# EAGLE schematic controller (EAGLE 6.1)
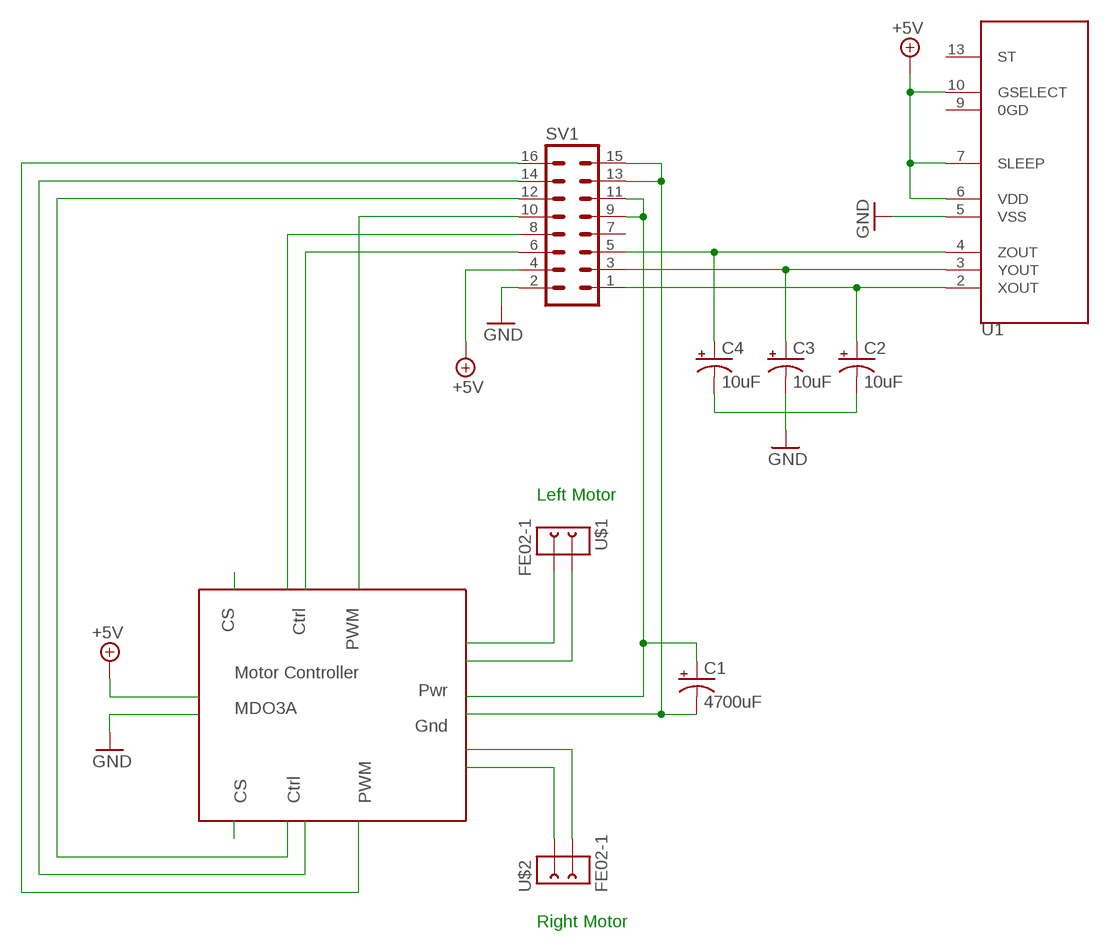
[diagram p0: schematic, sheet 1]

## Parts
C1  4700uF  CAP_POLPTH1  [CPOL-RADIAL-100UF-25V]
C2  10uF  CAP_POLPTH1  [CPOL-RADIAL-100UF-25V]
C3  10uF  CAP_POLPTH1  [CPOL-RADIAL-100UF-25V]
C4  10uF  CAP_POLPTH1  [CPOL-RADIAL-100UF-25V]
SV1  MA08-2  [MA08-2]
U1  MMA7361  [LGA14]
U$1  FE02-1  [FE02-1]
U$2  FE02-1  [FE02-1]

## Nets
+5V: SV1.4 U1.6(VDD) U1.7(SLEEP) U1.10(GSELECT)
GND: C2.2(-) C3.2(-) C4.2(-) SV1.2 U1.5(VSS)
N$1: C2.1(+) SV1.1 U1.2(XOUT)
N$2: C1.1(+) SV1.9 SV1.11
N$3: C1.2(-) SV1.13 SV1.15
N$4: U$2.P$1
N$5: U$2.P$2
N$6: U$1.P$2
N$7: U$1.P$1
N$8: C3.1(+) SV1.3 U1.3(YOUT)
N$9: C4.1(+) SV1.5 U1.4(ZOUT)
N$17: SV1.16
N$18: SV1.10
N$19: SV1.6
N$20: SV1.8
N$21: SV1.12
N$22: SV1.14
Unconnected: SV1.7 U1.9(0GD) U1.13(ST)

## Notes on the sheet
- Left Motor
- CS | Ctrl | PWM
- Motor Controller
- Pwr
- MDO3A
- Gnd
- CS | Ctrl | PWM
- Right Motor

## Library data of the parts
C1-C4 = SparkFun:CAP_POL: Capacitor Polarized These are standard SMD and PTH capacitors. Normally 10uF, 47uF, and 100uF in electrolytic and tantalum varieties. Always verify the external diameter of the through hole cap, it varies with capacity, voltage, and manufacturer. The EIA devices should be standard.
SV1 = con-lstb:MA08-2: PIN HEADER
U1 = SparkFun:MMA7361
U$1 U$2 = gatekeeper:FE02-1